# EAGLE design DC-DC-Brick (EAGLE 7.7.0)
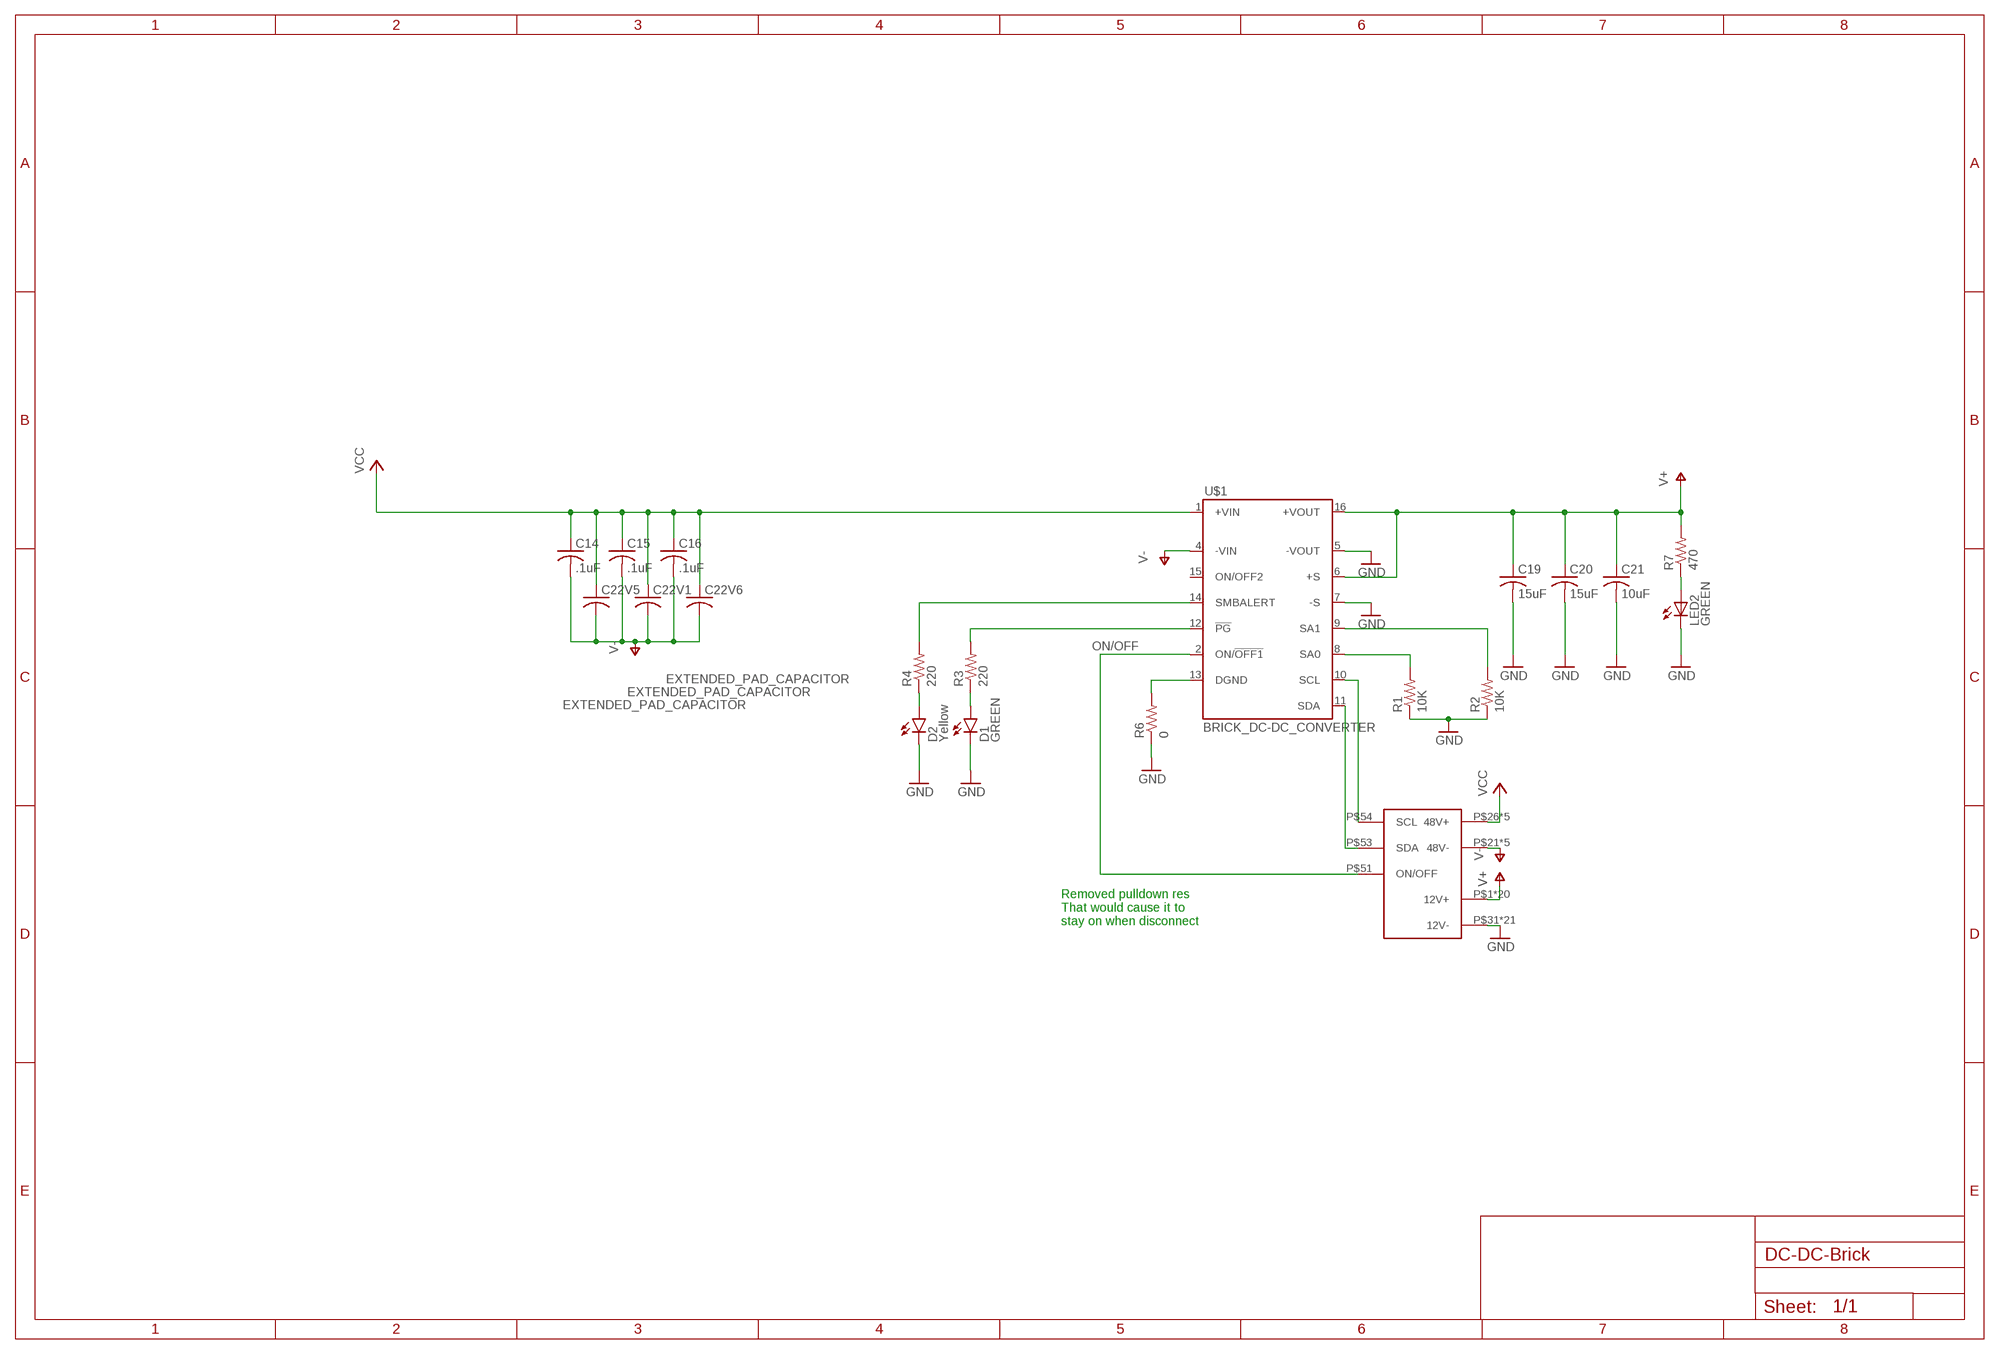
[diagram p0: schematic, sheet 1]

## Parts
C14  .1uF  C-USC0603  [C0603]
C15  .1uF  C-USC0603  [C0603]
C16  .1uF  C-USC0603  [C0603]
C19  15uF  C-USC3216  [C3216]
C20  15uF  C-USC3216  [C3216]
C21  10uF  C-USC0603  [C0603]
C22V1  EXTENDED_PAD_CAPACITOR  [MODIFIED-NICHICON-UX-8X10]
C22V5  EXTENDED_PAD_CAPACITOR  [MODIFIED-NICHICON-UX-8X10]
C22V6  EXTENDED_PAD_CAPACITOR  [MODIFIED-NICHICON-UX-8X10]
D1  GREEN  LED-GREEN0603  [LED-0603]
D2  Yellow  LED-YELLOW0603  [LED-0603]
LED2  GREEN  LED0603  [LED-0603]
R1  10K  10KOHM-1/10W-1%(0603)0603  [0603-RES]
R2  10K  10KOHM-1/10W-1%(0603)0603  [0603-RES]
R3  220  1KOHM-1/10W-1%(0603)  [0603-RES]
R4  220  1KOHM-1/10W-1%(0603)  [0603-RES]
R6  0  1KOHM-1/10W-1%(0603)  [0603-RES]
R7  470  470OHM1/10W1%(0603)  [0603-RES]
U$1  BRICK_DC-DC_CONVERTER  [BRICK_DC-DC_CONVERTER]
U$3  POWER-BRICK-CONNECTOR  [POWER-BRICK-CONNECTOR]

## Nets
GND: C19.2 C20.2 C21.2 D1.C D2.C LED2.C R1.1 R2.1 R6.1 U$1.5(-VOUT) U$1.7(-S) U$3.P$31(12V-) U$3.P$32(12V-) U$3.P$33(12V-) U$3.P$34(12V-) U$3.P$35(12V-) U$3.P$36(12V-) U$3.P$37(12V-) U$3.P$38(12V-) U$3.P$39(12V-) U$3.P$40(12V-) U$3.P$41(12V-) U$3.P$42(12V-) U$3.P$43(12V-) U$3.P$44(12V-) U$3.P$45(12V-) U$3.P$46(12V-) U$3.P$47(12V-) U$3.P$48(12V-) U$3.P$49(12V-) U$3.P$50(12V-) U$3.P$52(12V-)
N$1: R2.2 U$1.9(SA1)
N$2: R1.2 U$1.8(SA0)
N$3: R6.2 U$1.13(DGND)
N$4: D1.A R3.1
N$5: D2.A R4.1
N$6: R4.2 U$1.14(SMBALERT)
N$7: R3.2 U$1.12(!PG)
N$8: U$1.11(SDA) U$3.P$53(SDA)
N$10: U$1.10(SCL) U$3.P$54(SCL)
N$12: LED2.A R7.1
ON/OFF: U$1.2(ON/!OFF1) U$3.P$51(ON/OFF)
V+: C19.1 C20.1 C21.1 R7.2 U$1.6(+S) U$1.16(+VOUT) U$3.P$1(12V+) U$3.P$2(12V+) U$3.P$3(12V+) U$3.P$4(12V+) U$3.P$5(12V+) U$3.P$6(12V+) U$3.P$7(12V+) U$3.P$8(12V+) U$3.P$9(12V+) U$3.P$10(12V+) U$3.P$11(12V+) U$3.P$12(12V+) U$3.P$13(12V+) U$3.P$14(12V+) U$3.P$15(12V+) U$3.P$16(12V+) U$3.P$17(12V+) U$3.P$18(12V+) U$3.P$19(12V+) U$3.P$20(12V+)
V-: C14.2 C15.2 C16.2 C22V1.P$1 C22V5.P$1 C22V6.P$1 U$1.4(-VIN) U$3.P$21(48V-) U$3.P$22(48V-) U$3.P$23(48V-) U$3.P$24(48V-) U$3.P$25(48V-)
VCC: C14.1 C15.1 C16.1 C22V1.P$3 C22V5.P$3 C22V6.P$3 U$1.1(+VIN) U$3.P$26(48V+) U$3.P$27(48V+) U$3.P$28(48V+) U$3.P$29(48V+) U$3.P$30(48V+)
Unconnected: U$1.15(ON/OFF2)

## Notes on the sheet
- Removed pulldown res
  That would cause it to
  stay on when disconnect

## Library data of the parts
C14-C16 C19-C21 = rcl:C-US: CAPACITOR, American symbol
C22V1 C22V5 C22V6 = PowerComponents:EXTENDED_PAD_CAPACITOR: This is an updated version of the capacitor from package: NICHICON-UX-8X10, Library: ux-capacitor. The old capacitor that was used didnt have enough space to solder on a 22uF capacitor efectivly so this one has longer and slightly wider pads.
D1 = SparkFun-LED:LED-GREEN: Various green LEDs Green LEDs used in SFE Production 0603- DIO-00821 LARGE- DIO-00862 LILYPAD- DIO-09910; PROD_ID: DIO-00821
D2 = SparkFun-LED:LED-YELLOW: Yellow SMD LEDs LilyPad 1206- DIO-09909 0603- DIO-09003 "SMART" means more efficient and expensive; PROD_ID: DIO-09003
LED2 = SparkFun:LED: LEDs Standard schematic elements and footprints for 5mm, 3mm, 1206, and 0603 sized LEDs. 5mm - Spark Fun Electronics SKU : COM-00529 (and others); BOM: INCLUDE; PARTNO: 160-1446-1-ND
R1 R2 = SparkFun-Resistors:10KOHM-1/10W-1%(0603): RES-00824; PROD_ID: RES-00824
R3 R4 R6 = SparkFun-Resistors:1KOHM-1/10W-1%(0603): RES-07856; PROD_ID: RES-07856; VALUE: 1K
R7 = SparkFun-Resistors:470OHM1/10W1%(0603): RES-07869; PROD_ID: RES-07869
U$1 = PowerComponents:BRICK_DC-DC_CONVERTER: DRQ-12/50-L48 Series 600W Digital Fully Regulated Intermediate DC-DC Bus Converter
U$3 = MotherboardParts:POWER-BRICK-CONNECTOR

## Board
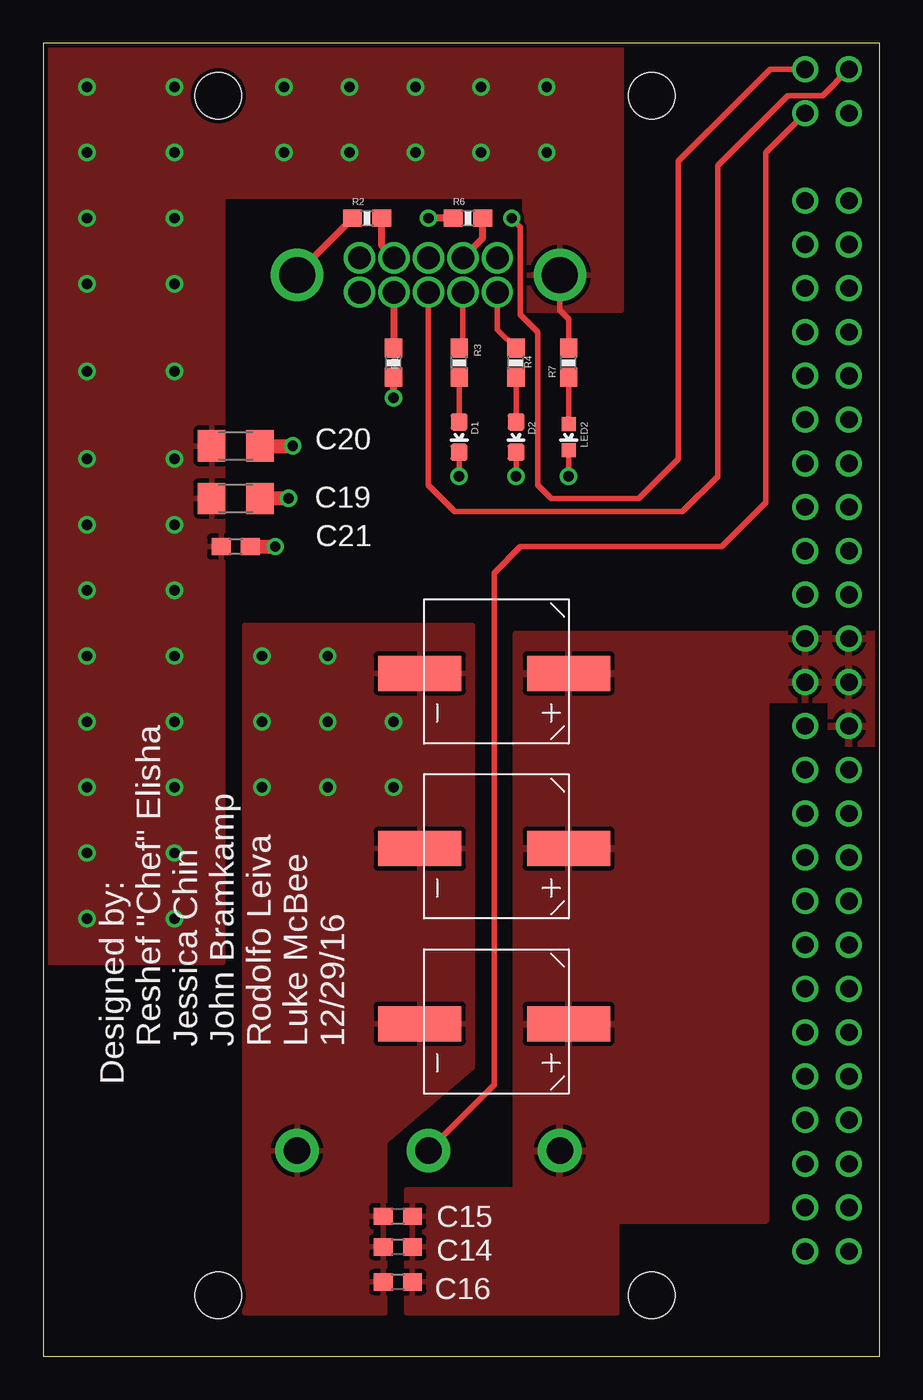
[diagram p1: board, top side]
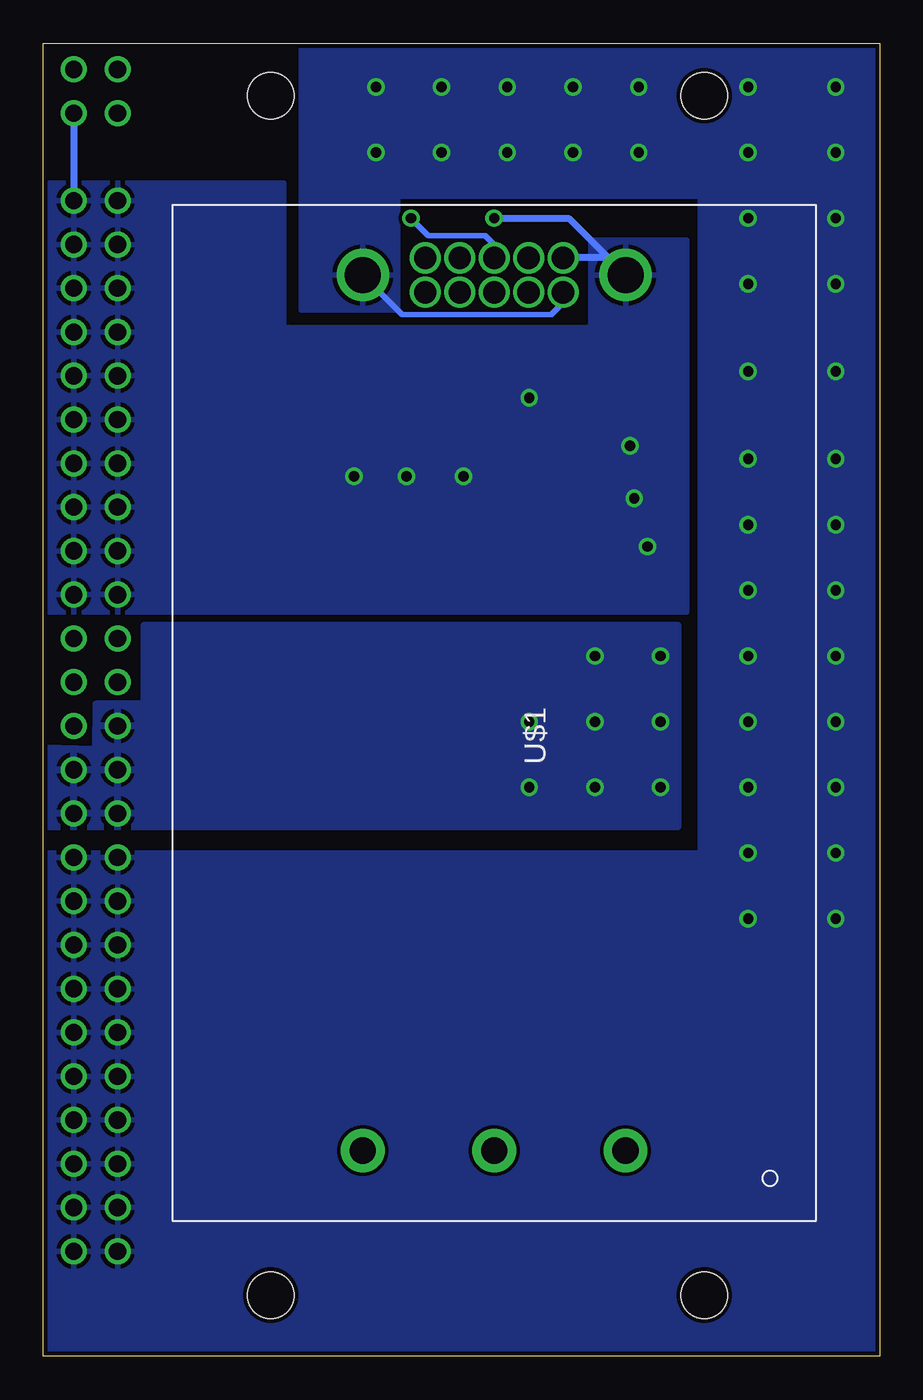
[diagram p2: board, bottom side, seen from below]

Size 48.51 x 76.2 mm. Coordinates in mm from the lower left corner, seen from the top.
Outline: 0,0 48.51,0 48.51,76.2 0,76.2 0,0
Copper layers (1*16): Top 0.035mm / dielectric 1.5mm / Bottom 0.035mm
Design rules "default *": minimum track width 10mil, minimum drill 24mil, track to track 8mil, track to pad 8mil, pad to pad 7mil, via to via 8mil, smd to smd 7mil, copper to edge 10mil, drill to drill 8mil, minimum pad ring 10mil, minimum via ring 8mil, stop-mask expansion 4mil, vias tented up to drill 0mil, thermal gap 10mil
Holes 2.69 mm at 10.16,3.56 35.31,3.56 10.16,73.15 35.31,73.15

### Footprints (pad centres in the part's own frame; a part is rotated, then mirrored left to right if it is on the bottom)
C0603 = smd 1.1 x 1: 1 -0.85,0; 2 0.85,0
C3216 = smd 1.6 x 1.8: 1 -1.4,0; 2 1.4,0
MODIFIED-NICHICON-UX-8X10 = smd 2.032 x 4.826: P$1 4.318,-0.254; P$3 4.318,8.382
LED-0603 = smd 1 x 1: A 0,-0.877; C 0,0.877
LED-0603' = smd 0.8 x 0.8: A 0,-0.75; C 0,0.75
0603-RES = smd 1.1 x 1: 1 -0.85,0; 2 0.85,0
BRICK_DC-DC_CONVERTER = drill 1.524 pad 2.54: 1 -25.4,7.62; 2 -25.4,0; 4 -25.4,-7.62 | drill 2.083 pad 3.048: 5 25.4,-7.62; 16 25.4,7.62 | drill 1.295 pad 1.778: 6 24.4,-4; 7 26.4,-4; 8 24.4,-2; 9 26.4,-2; 10 24.4,0; 11 26.4,0; 12 24.4,2; 13 26.4,2; 14 24.4,4; 15 26.4,4
POWER-BRICK-CONNECTOR = drill 1: P$1 -1.27,-34.29; P$2 1.27,-34.29; P$3 -1.27,-31.75; P$4 1.27,-31.75; P$5 -1.27,-29.21; P$6 1.27,-29.21; P$7 -1.27,-26.67; P$8 1.27,-26.67; P$9 -1.27,-24.13; P$10 1.27,-24.13; P$11 -1.27,-21.59; P$12 1.27,-21.59; P$13 -1.27,-19.05; P$14 1.27,-19.05; P$15 -1.27,-16.51; P$16 1.27,-16.51; P$17 -1.27,-13.97; P$18 1.27,-13.97; P$19 -1.27,-11.43; P$20 1.27,-11.43; P$21 -1.27,-8.89; P$22 1.27,-8.89; P$23 -1.27,-6.35; P$24 1.27,-6.35; P$25 -1.27,-3.81; P$26 1.27,-3.81; P$27 -1.27,-1.27; P$28 1.27,-1.27; P$29 -1.27,1.27; P$30 1.27,1.27; P$31 -1.27,3.81; P$32 1.27,3.81; P$33 -1.27,6.35; P$34 1.27,6.35; P$35 -1.27,8.89; P$36 1.27,8.89; P$37 -1.27,11.43; P$38 1.27,11.43; P$39 -1.27,13.97; P$40 1.27,13.97; P$41 -1.27,16.51; P$42 1.27,16.51; P$43 -1.27,19.05; P$44 1.27,19.05; P$45 -1.27,21.59; P$46 1.27,21.59; P$47 -1.27,24.13; P$48 1.27,24.13; P$49 -1.27,26.67; P$50 1.27,26.67; P$51 -1.27,31.75; P$52 1.27,31.75; P$53 -1.27,34.29; P$54 1.27,34.29

### Placement (x,y rotation side)
C14  20.57,6.35 180 top
C15  20.57,8.13 180 top
C16  20.57,4.32 180 top
C19  11.18,49.78 0 top
C20  11.18,52.83 0 top
C21  11.18,46.99 0 top
C22V1  22.1,43.94 270 top
C22V5  22.1,33.78 270 top
C22V6  22.1,23.62 270 top
D1  24.13,53.34 180 top
D2  27.43,53.34 180 top
LED2  GREEN  [LED-0603']  30.48,53.34 180 top
R1  20.32,57.66 90 top
R2  18.8,66.04 0 top
R3  24.13,57.66 90 top
R4  27.43,57.66 90 top
R6  24.64,66.04 0 top
R7  30.48,57.66 90 top
U$1  22.35,37.34 90 bottom
U$3  45.47,40.39 0 top

### Tracks (layer width: path | path; a pad name or v marks a point on that pad's centre or on a via)
GND  (via drill 0.6)
  Top 0.305: D1.C v24.13,51.05 | D2.C v27.43,51.05 | LED2.C v30.48,51.05
  Top 0.406: R1.1 v20.32,55.63 | R6.1 v22.35,66.04 | R2.1 14.73,62.83 U$1.5
  Top 0.813: C20.2 v14.48,52.83 | v14.22,49.78 C19.2 | C21.2 v13.46,46.99
  Bottom 0.406: U$3.P$52 U$3.P$50 | U$1.7 15.73,63.74 U$1.5 18.03,66.04 v22.35,66.04
  pour Bottom (rank 6): 48.51,43.18 11.18,43.18 11.18,64.77 16.76,64.77 16.76,59.69 34.54,59.69 34.54,68.07 48.51,68.07
N$1
  Top 0.406: U$1.9 19.65,64.44 R2.2
N$2
  Top 0.406: U$1.8 20.35,58.54 R1.2
N$3
  Top 0.406: U$1.13 25.49,64.87 R6.2
N$4
  Top 0.305: R3.1 D1.A
N$5
  Top 0.305: R4.1 D2.A
N$6
  Top 0.305: U$1.14 26.35,59.59 R4.2
N$7
  Top 0.305: U$1.12 24.35,58.73 R3.2
N$8  (via drill 0.6)
  Top 0.305: U$3.P$53 42.16,74.68 36.83,69.34 36.83,52.07 34.54,49.78 29.46,49.78 28.7,50.55 28.7,59.44 27.69,60.45 27.69,65.53 v27.18,66.04
  Bottom 0.305: v27.18,66.04 26.16,65.02 22.86,65.02 22.35,64.52 U$1.11
N$10
  Top 0.305: U$1.10 22.35,50.55 23.88,49.02 37.08,49.02 39.12,51.05 39.12,69.09 43.18,73.15 45.21,73.15 U$3.P$54
N$12
  Top 0.305: R7.1 LED2.A
ON/OFF
  Top 0.305: U$1.2 26.16,15.75 26.16,45.47 27.69,46.99 39.37,46.99 41.91,49.53 41.91,69.85 U$3.P$51
V+  (via drill 0.6)
  Top 0.305: R7.2 30.48,60.2 29.97,60.71 U$1.16
  Bottom 0.305: U$1.16 27.69,60.45 19.05,60.45 18.35,61.15 U$1.6
  other vias: 2.54,25.4 2.54,29.21 2.54,33.02 2.54,36.83 2.54,40.64 2.54,44.45 2.54,48.26 2.54,52.07 2.54,57.15 2.54,62.23 2.54,66.04 2.54,69.85 2.54,73.66 7.62,25.4 7.62,29.21 7.62,33.02 7.62,36.83 7.62,40.64 7.62,44.45 7.62,48.26 7.62,52.07 7.62,57.15 7.62,62.23 7.62,66.04 7.62,69.85 7.62,73.66 13.97,69.85 13.97,73.66 17.78,73.66 17.78,69.85 21.59,69.85 21.59,73.66 25.4,73.66 25.4,69.85 29.21,69.85 29.21,73.66
  pour Bottom (rank 2): 48.51,29.21 48.51,0 0,0 0,76.2 33.53,76.2 33.53,60.71 27.94,60.71 27.94,67.31 10.41,67.31 10.41,29.21
  pour Top (rank 2): 0,22.86 0,75.95 33.53,75.95 33.53,60.71 27.94,60.71 27.94,67.31 10.41,67.31 10.41,22.86
V-  (via drill 0.6)
  other vias: 12.7,40.64 16.51,40.64 16.51,36.83 12.7,36.83 12.7,33.02 16.51,33.02 20.32,33.02 20.32,36.83
  pour Bottom (rank 3): 48.51,30.73 11.68,30.73 11.68,42.42 42.67,42.42 42.67,37.85 45.47,37.85 45.49,35.2 48.51,35.31
  pour Top (rank 3): 11.68,42.42 11.68,2.54 19.81,2.54 19.81,12.45 24.89,16.76 24.89,42.42
VCC
  pour Top: 48.51,41.91 48.51,35.56 45.72,35.56 45.72,38.1 41.91,38.1 41.91,7.87 27.43,7.87 27.43,41.91
  pour Top: 21.08,9.65 21.08,2.54 33.27,2.54 33.27,14.22 27.43,14.22 27.43,9.65

### Text on the board
tPlace: Designed by: / Reshef "Chef" Elisha / Jessica Chin / John Bramkamp / Rodolfo Leiva / Luke McBee / 12/29/16